# EAGLE design Mabee_Button V1.1 (EAGLE 6.1)
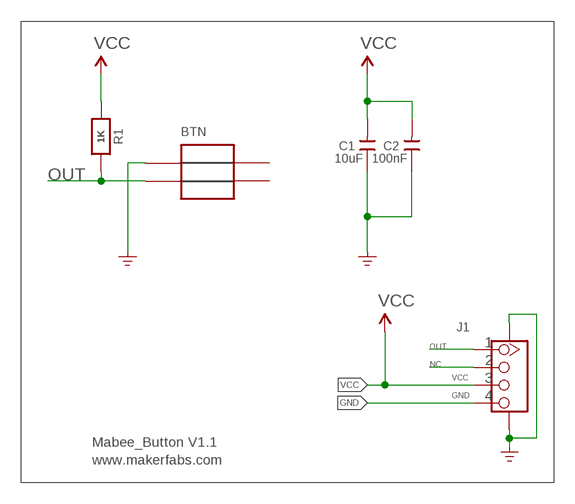
[diagram p0: schematic, sheet 1]

## Parts
BTN  BUTTON_1212  [12*12_BUTTON_DIP]
C1  10uF  C-0603  [0603]
C2  100nF  C-0603  [0603]
J1  GROVE-CONNECTOR-SMD'90D'  [HW4-SMD-2.0-90D]
R1  1K  RESISTOR_0603_NOOUT  [0603-NO]

## Nets
GND: BTN.1 C1.1 C2.1 J1.4 J1.SS1 J1.SS2
NC: J1.2
OUT: BTN.3 J1.1 R1.2
VCC: C1.2 C2.2 J1.3 R1.1
Unconnected: BTN.2 BTN.4

## Notes on the sheet
- Mabee_Button V1.1
- www.makerfabs.com

## Library data of the parts
BTN = 1mytest:BUTTON_12*12
C1 C2 = Discrete:C*: Ceramic Capacitors
J1 = Connector-new:GROVE-CONNECTOR-SMD: 4P-SMD-2.0:320110030;4P-SMD-2.0-90D:320110032
R1 = microbuilder:RESISTOR: Resistors For new designs, use the packages preceded by an '_' character since they are more reliable: The following footprints should be used on most boards: _0402 - Standard footprint for regular board layouts _0603 - Standard footprint for regular board layouts _0805 - Standard footprint for regular board layouts _1206 - Standard footprint for regular board layouts For extremely tight-pitch boards where space is at a premium, the following 'micro-pitch' footprints can be used (smaller pads, no silkscreen outline, etc.): _0402MP - Micro-pitch footprint for very dense/compact boards _0603MP - Micro-pitch footprint for very dense/compact boards _0805MP - Micro-pitch footprint for very dense/compact boards _1206MP - Micro-pitch footprint for very dense/compact boards

## Net classes
0 default: width 0.152 mm, drill 0.305 mm, clearance 0.152 mm

## Board
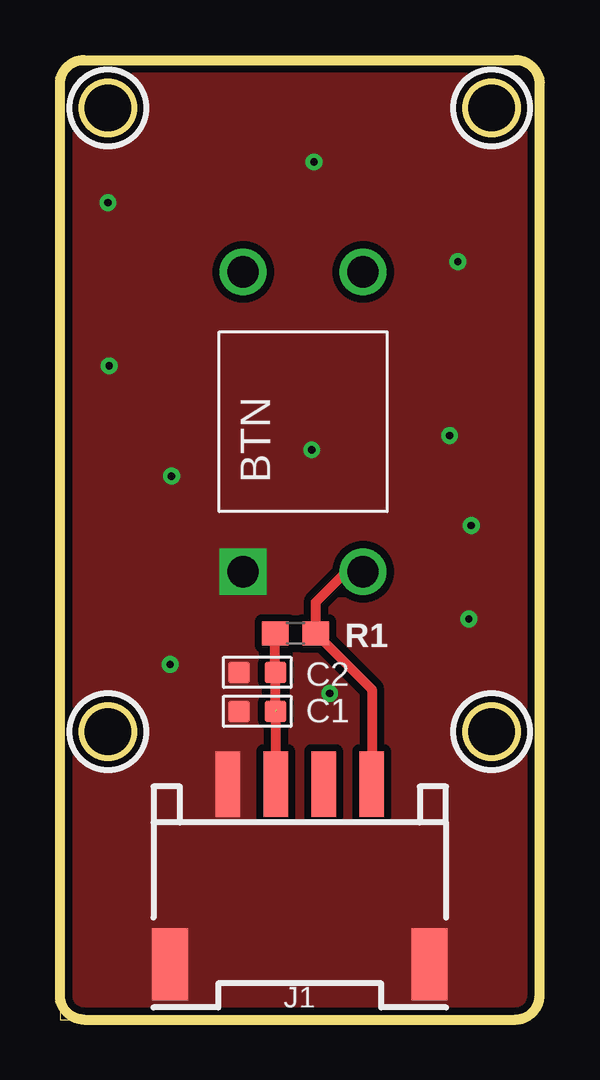
[diagram p1: board, top side]
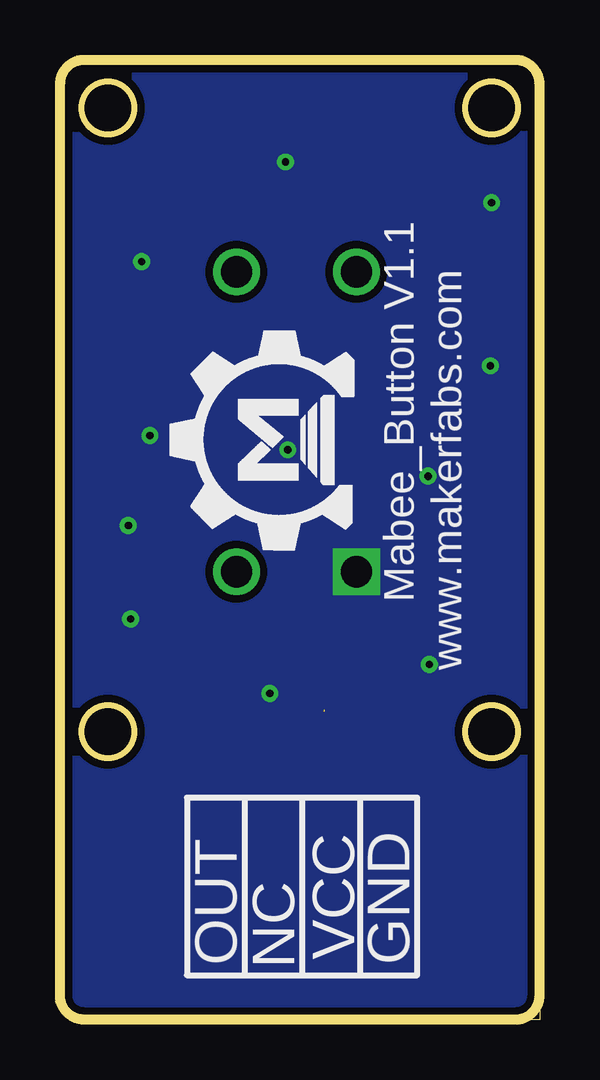
[diagram p2: board, bottom side, seen from below]

Size 20 x 40 mm. Coordinates in mm from the lower left corner, seen from the top.
Outline: 1,0 0,0 0,1
Outline: 1,0 19,0 arc90 20,1 20,39 arc90 19,40 1,40 arc90 0,39 0,1
Outline: 1,0 arc-90 0,1
Outline: circle at 2,12 radius 1.1
Outline: circle at 18,12 radius 1.1
Outline: circle at 2,38 radius 1.1
Outline: circle at 18,38 radius 1.1
Copper layers (1*16): Top 0.035mm / dielectric 1.5mm / Bottom 0.035mm
Design rules: minimum track width 10mil, minimum drill 24mil, track to track 8mil, track to pad 8mil, pad to pad 8mil, via to via 8mil, smd to smd 8mil, copper to edge 10mil, drill to drill 8mil, minimum pad ring 10mil, minimum via ring 8mil, stop-mask expansion 4mil, vias tented up to drill 100mil, thermal gap 0mil

### Footprints (pad centres in the part's own frame; a part is rotated, then mirrored left to right if it is on the bottom)
12*12_BUTTON_DIP = drill 1.3 square: 1 0,5 | drill 1.3: 2 12.5,5; 3 0,0; 4 12.5,0
0603 = smd 0.889 x 0.889: 1 -0.762,0; 2 0.762,0
HW4-SMD-2.0-90D = smd 1.01 x 2.74: 1 -3,-0.1; 2 -1,-0.1; 3 1,-0.1; 4 3,-0.1 | smd 1.5 x 3: SS1 -5.4,7.4; SS2 5.4,7.4
0603-NO = smd 1.1 x 1: 1 -0.85,0; 2 0.85,0

### Placement (x,y rotation side)
BTN  12.64,18.67 90 top
C1  8.23,12.85 0 top
C2  8.23,14.48 0 top
J1  10,9.71 180 top
R1  9.82,16.09 0 top
U$3  [MAKERFABS_0.3]  7.8,20.05 90 bottom

### Tracks (layer width: path | path; a pad name or v marks a point on that pad's centre or on a via)
GND  (via drill 0.3)
  other vias: 10.6,35.75 2,34.05 16.6,31.6 2.05,27.25 10.5,23.75 16.25,24.35 4.65,22.65 4.6,14.8 17.05,16.7 17.15,20.6 11.25,13.6
  pour Top (isolate 0.305, no thermals): -3.65,18.9 -3.65,-1.08 -2.38,-2.35 9.2,-2.35 21.68,-2.35 22.95,-1.08 22.95,16.4 22.95,41.78 21.68,43.05 9.45,43.05 -2.38,43.05 -3.65,41.78
  pour Bottom (isolate 0.305): -2.15,28.8 -2.15,40.48 -0.88,41.75 8.4,41.75 20.48,41.75 21.75,40.48 21.75,28.05 21.75,-0.18 20.48,-1.45 10,-1.45 -0.88,-1.45 -2.15,-0.18
OUT
  Top 0.406: J1.1 13,13.76 R1.2 10.67,17.4 11.94,18.67 BTN.3
VCC  (1 unrouted)
  Top 0.406: J1.3 9,12.9 | C1.2 C2.2 8.97,14.5 R1.1 8.91,16.09

### Text on the board
bPlace: Mabee_Button V1.1 | www.makerfabs.com
bNames: GND | VCC | OUT | NC